# EAGLE schematic Nusbio.smd (EAGLE 7.2.0)
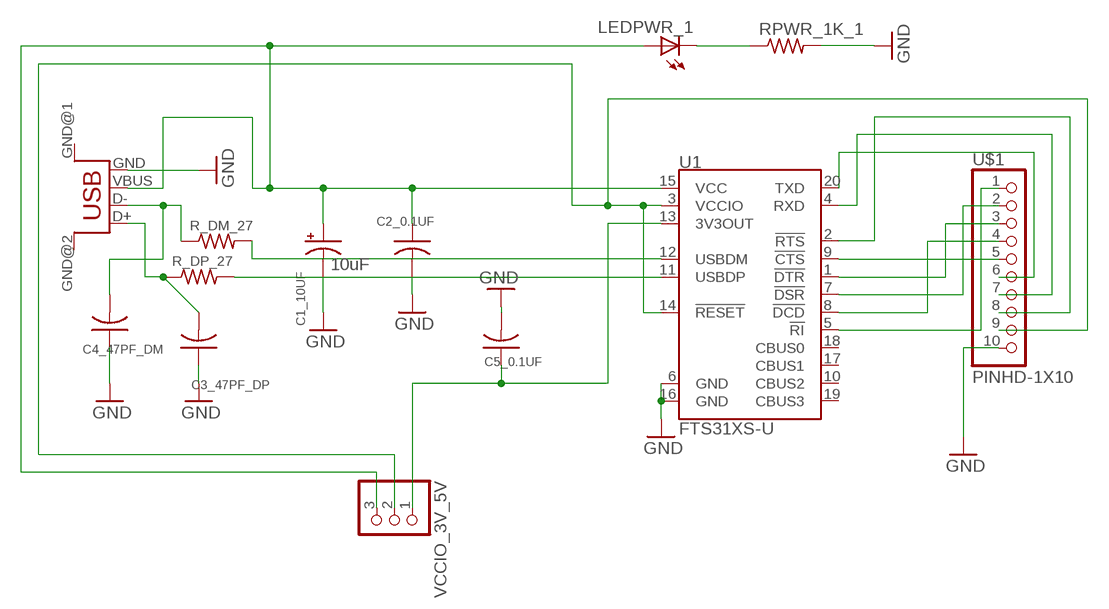
[diagram p0: schematic, sheet 1]

## Parts
C1_10UF  10uF  10UF-16V-10%(TANT)  [EIA3216]
C2_0.1UF  C-USC1206  [C1206]
C3_47PF_DP  C-USC1206  [C1206]
C4_47PF_DM  C-USC1206  [C1206]
C5_0.1UF  C-USC1206  [C1206]
LEDPWR_1  LEDCHIPLED_0805  [CHIPLED_0805]
R_DM_27  R-US_R0805  [R0805]
R_DP_27  R-US_R0805  [R0805]
RPWR_1K_1  R-US_R0805  [R0805]
U1  FTS31XS-U  FT231XS  [SSOP20_L]
U$1  PINHD-1X10  [1X10-BIG]
USB_FEMALE  USB  [USB-FEMALE-A-PTH]
VCCIO_3V_5V  PINHD-1X3  [1X03]

## Nets
GND: C1_10UF.C(-) C2_0.1UF.2 C3_47PF_DP.1 C4_47PF_DM.1 C5_0.1UF.2 RPWR_1K_1.2 U1.6(GND) U1.16(GND) U$1.10 USB_FEMALE.GND
N$1: C1_10UF.A(+) C2_0.1UF.1 LEDPWR_1.A U1.15(VCC) USB_FEMALE.VBUS VCCIO_3V_5V.3
N$2: C5_0.1UF.1 U1.13(3V3OUT) VCCIO_3V_5V.1
N$3: LEDPWR_1.C RPWR_1K_1.1
N$4: R_DM_27.2 U1.12(USBDM)
N$5: R_DP_27.2 U1.11(USBDP)
N$6: U1.20(TXD) U$1.6
N$7: U1.7(!DSR) U$1.2
N$8: U1.5(!RI) U$1.1
N$9: U1.1(!DTR) U$1.3
N$10: U1.8(!DCD) U$1.4
N$11: U1.9(!CTS) U$1.5
N$12: U1.4(RXD) U$1.7
N$13: U1.2(!RTS) U$1.8
N$14: U1.3(VCCIO) U1.14(!RESET) U$1.9 VCCIO_3V_5V.2
N$15: C3_47PF_DP.2 R_DP_27.1 USB_FEMALE.D+
N$16: C4_47PF_DM.2 R_DM_27.1 USB_FEMALE.D-
Unconnected: U1.10(CBUS2) U1.17(CBUS1) U1.18(CBUS0) U1.19(CBUS3) USB_FEMALE.GND@1(GND) USB_FEMALE.GND@2(GND)

## Library data of the parts
C1_10UF = SparkFun-Capacitors:10UF-16V-10%(TANT): CAP-00811 1206/EIA-3216 Tantalum capacitor; PROD_ID: CAP-00811
C2_0.1UF C3_47PF_DP C4_47PF_DM C5_0.1UF = adafruit:C-US: CAPACITOR, American symbol
LEDPWR_1 = adafruit:LED: LED OSRAM: - CHIPLED LG R971, LG N971, LY N971, LG Q971, LY Q971, LO R971, LY R971 LH N974, LH R974 LS Q976, LO Q976, LY Q976 LO Q996 - Hyper CHIPLED LW Q18S LB Q993, LB Q99A, LB R99A - SideLED LS A670, LO A670, LY A670, LG A670, LP A670 LB A673, LV A673, LT A673, LW A673 LH A674 LY A675 LS A676, LA A676, LO A676, LY A676, LW A676 LS A679, LY A679, LG A679 - Hyper Micro SIDELED® LS Y876, LA Y876, LO Y876, LY Y876 LT Y87S - SmartLED LW L88C, LW L88S LB L89C, LB L89S, LG L890 LS L89K, LO L89K, LY L89K LS L896, LA L896, LO L896, LY L896 - TOPLED LS T670, LO T670, LY T670, LG T670, LP T670 LSG T670, LSP T670, LSY T670, LOP T670, LYG T670 LG T671, LOG T671, LSG T671 LB T673, LV T673, LT T673, LW T673 LH T674 LS T676, LA T676, LO T676, LY T676, LB T676, LH T676, LSB T676, LW T676 LB T67C, LV T67C, LT T67C, LS T67K, LO T67K, LY T67K, LW E67C LS E67B, LA E67B, LO E67B, LY E67B, LB E67C, LV E67C, LT E67C LW T67C LS T679, LY T679, LG T679 LS T770, LO T770, LY T770, LG T770, LP T770 LB T773, LV T773, LT T773, LW T773 LH T774 LS E675, LA E675, LY E675, LS T675 LS T776, LA T776, LO T776, LY T776, LB T776 LHGB T686 LT T68C, LB T68C - Hyper Mini TOPLED® LB M676 - Mini TOPLED Santana® LG M470 LS M47K, LO M47K, LY M47K Source: http://www.osram.convergy.de/
R_DM_27 R_DP_27 RPWR_1K_1 = adafruit:R-US_: RESISTOR, American symbol
U1 = SparkFun-DigitalIC:FT231X: FTDI FT231X Full Speed USB to Full-handshake UART This USB2.0 Full Speed IC offers a compact bridge to full handshake UART interfaces. The device is a UART, capable of operating up to 3MBaud, with low power consumption (8mA). The FT231X includes the complete FT-X series feature set and enables USB to be added into a system design quickly and easily over a UART interface.; PROD_ID: IC-11524
U$1 = adafruit:PINHD-1X10: Pin header 1x10 0.1" spacing With round pins
USB_FEMALE = STUNTAZ:USB: USB Connectors USB-FEMALE-A-PTH: Through hole Female Type A Connector
VCCIO_3V_5V = adafruit:PINHD-1X3: PIN HEADER